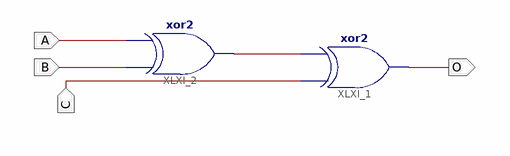
[diagram p0: schematic sheet 1]
// Xilinx ISE schematic MY_XOR_3.sch (spartan3e) as structural Verilog: 2 symbols, 4 ports
module MY_XOR_3 (
  input  C,
  input  A,
  input  B,
  output O
);

  wire XLXN_1;

  xor XLXI_1 (O, C, XLXN_1);
  xor XLXI_2 (XLXN_1, B, A);
endmodule
